# Altium schematic sheet SX1308_GTW_e381v02c_STM32_MCU.SchDoc
size B; DrawnBy: Erik Fountain; DocumentNumber: 3; SheetNumber: 3; SheetTotal: 5; PageSetup: Record=PageOptions|CenterHorizontal=True|CenterVertical=True|PrintScale=0.72|XCorrection=1.00|YCorrection=1.00|PrintKind=0|BorderSize=5000000|LeftOffset=0|BottomOffset=0|Orientation=2|PaperLength=1000|PaperWidth=1000|Scale=100|PaperSource=7|PrintQuality=-4|MediaType=1|DitherType=10|PaperKind=Letter|PrintScaleMode=1
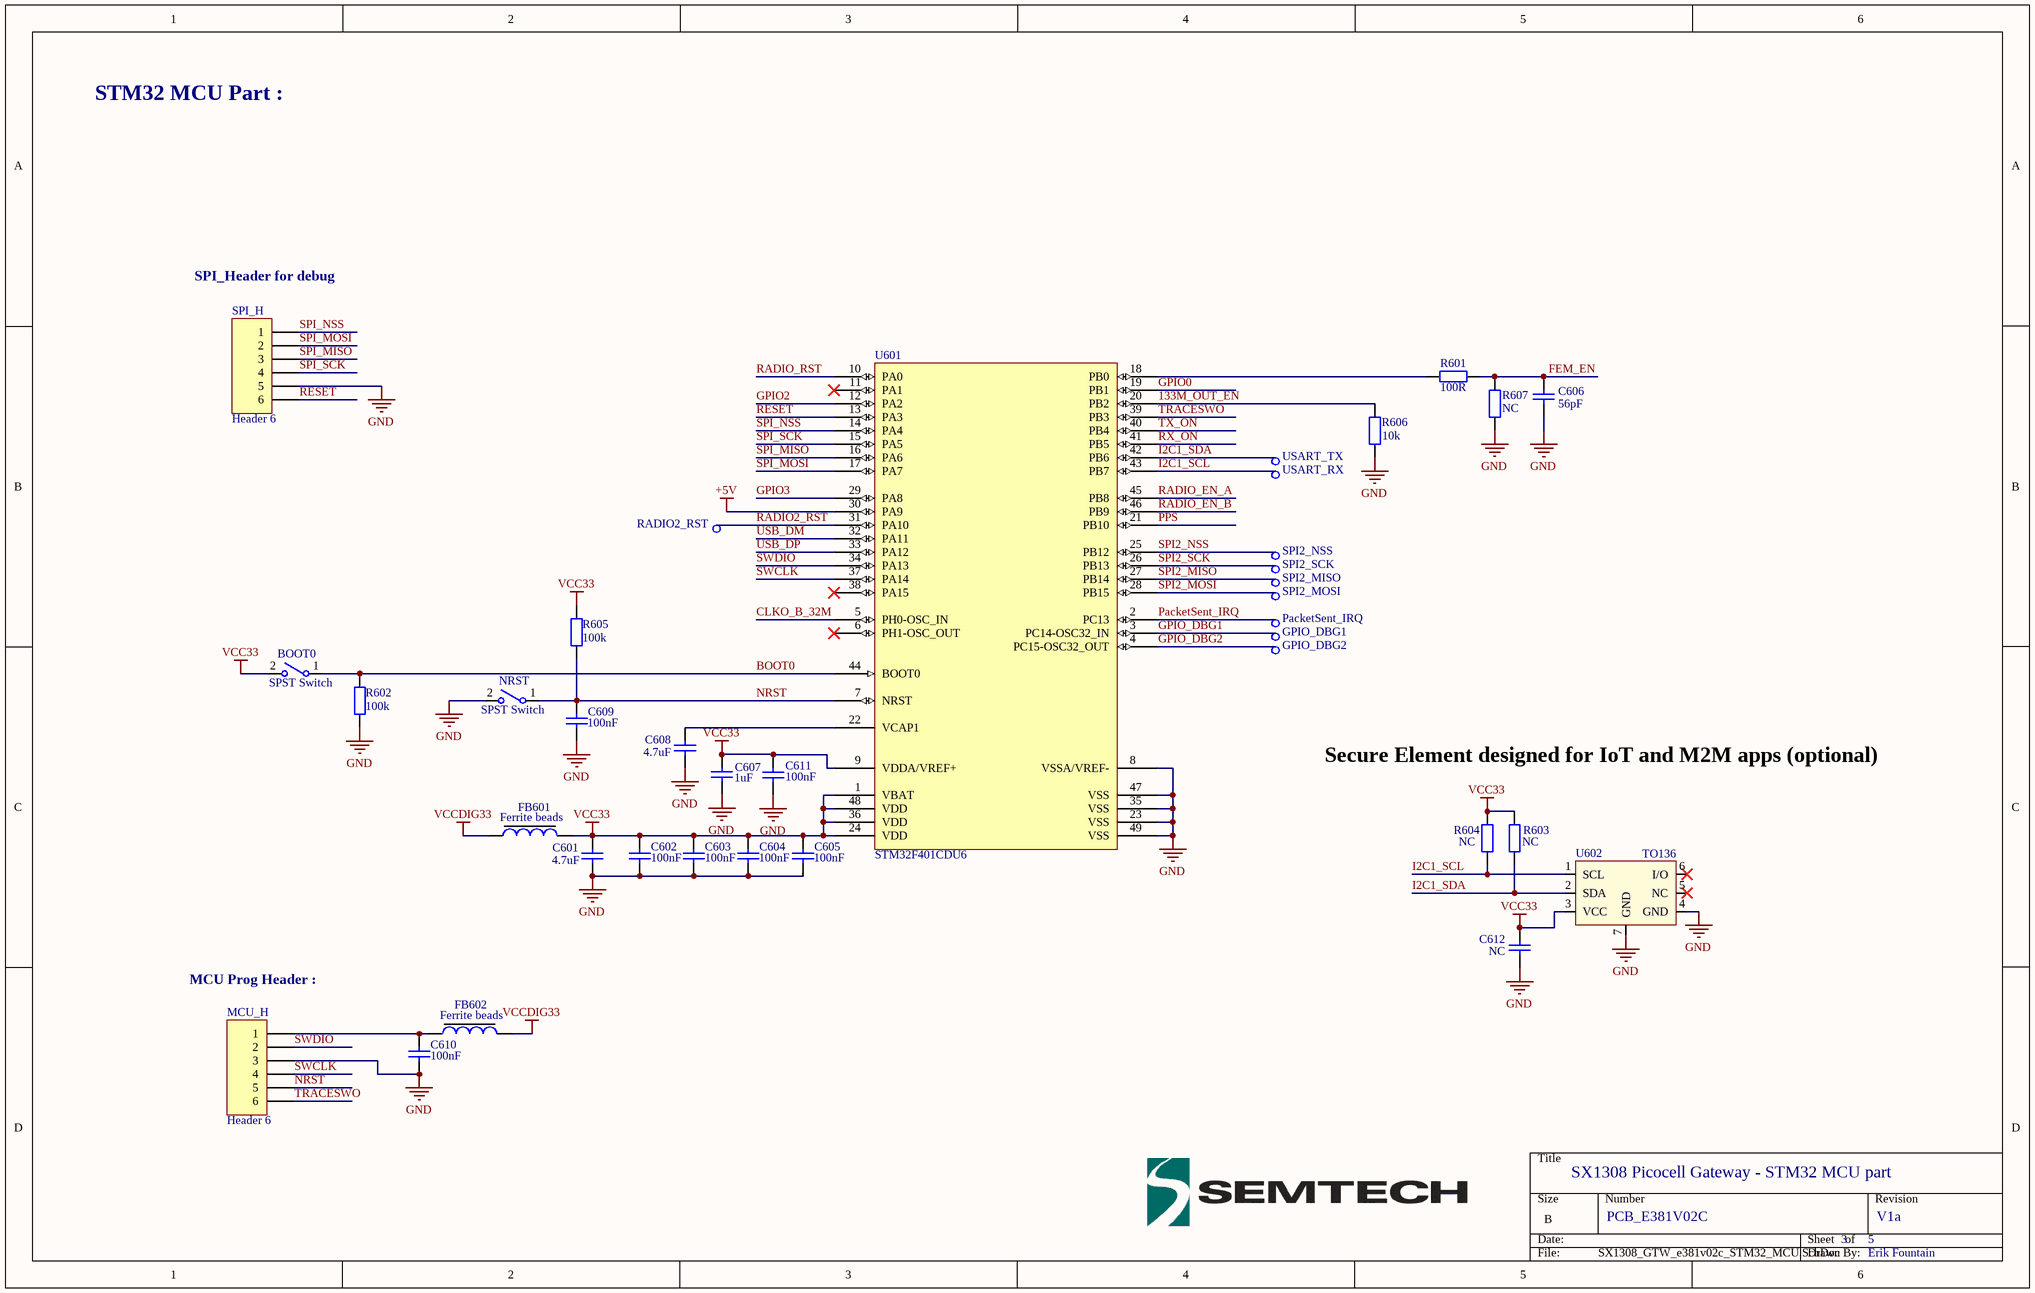
[diagram p0: SX1308_GTW_e381v02c_STM32_MCU.SchDoc]

## Parts
BOOT0  SPST Switch  [KXT_series_switch_3.5x2.0mm]
C601  value 4.7uF  [rlc_603_smd]  (hidden comment: Cap)
C602  value 100nF  [rlc_402_smd]  (hidden comment: Cap)
C603  value 100nF  [rlc_402_smd]  (hidden comment: Cap)
C604  value 100nF  [rlc_402_smd]  (hidden comment: Cap)
C605  value 100nF  [rlc_402_smd]  (hidden comment: Cap)
C606  value 56pF  [rlc_402_smd]  (hidden comment: Cap)
C607  value 1uF  [rlc_402_smd]  (hidden comment: Cap)
C608  value 4.7uF  [rlc_603_smd]  (hidden comment: Cap)
C609  value 100nF  [rlc_402_smd]  (hidden comment: Cap)
C610  value 100nF  [rlc_402_smd]  (hidden comment: Cap)
C611  value 100nF  [rlc_402_smd]  (hidden comment: Cap)
C612  value NC  [rlc_402_smd]  (hidden comment: Cap)
FB601  Ferrite beads  [rlc_402_smd]
FB602  Ferrite beads  [rlc_402_smd]
GPIO_DBG1  Test Pin  [PIN_SMD]  (value not drawn)
GPIO_DBG2  Test Pin  [PIN_SMD]  (value not drawn)
MCU_H  Header 6  [HDR1X6_SMD]
NRST  SPST Switch  [KXT_series_switch_3.5x2.0mm]
PacketSent_IRQ  Test Pin  [PIN_SMD]  (value not drawn)
R601  value 100R  [rlc_402_smd]  (hidden comment: Resistor)
R602  value 100k  [rlc_402_smd]  (hidden comment: Resistor)
R603  value NC  [rlc_201_smd]  (hidden comment: Resistor)
R604  value NC  [rlc_201_smd]  (hidden comment: Resistor)
R605  value 100k  [rlc_402_smd]  (hidden comment: Resistor)
R606  value 10k  [rlc_402_smd]  (hidden comment: Resistor)
R607  value NC  [rlc_402_smd]  (hidden comment: Resistor)
RADIO2_RST  Test Pin  [PIN_SMD]  (value not drawn)
SPI2_MISO  Test Pin  [PIN_SMD]  (value not drawn)
SPI2_MOSI  Test Pin  [PIN_SMD]  (value not drawn)
SPI2_NSS  Test Pin  [PIN_SMD]  (value not drawn)
SPI2_SCK  Test Pin  [PIN_SMD]  (value not drawn)
SPI_H  Header 6  [HDR1X6_SMD]
U601  STM32F401CDU6  [UFQFPN48_7x7MM]
U602  TO136  [DFN6_3X3mm]
USART_RX  Test Pin  [PIN_SMD]  (value not drawn)
USART_TX  Test Pin  [PIN_SMD]  (value not drawn)

## Nets
+5V: U601.30(PA9)
GND: C601.1 C602.1 C603.1 C604.1 C605.1 C606.1 C607.1 C608.1 C609.1 C610.1 C611.1 C612.1 MCU_H.3 NRST.2(NO) R602.1 R606.1 R607.1 SPI_H.5 U601.8(VSSA/VREF-) U601.23(VSS) U601.35(VSS) U601.47(VSS) U601.49(VSS) U602.4(GND) U602.7(GND)
VCC33: BOOT0.2(NO) C601.2 C602.2 C603.2 C604.2 C605.2 C607.2 C611.2 C612.2 FB601.2 R603.2 R604.2 R605.2 U601.1(VBAT) U601.9(VDDA/VREF+) U601.24(VDD) U601.36(VDD) U601.48(VDD) U602.3(VCC)
VCCDIG33: FB601.1 FB602.2
133M_OUT_EN: R606.2 U601.20(PB2)
BOOT0: BOOT0.1(COMMON) R602.2 U601.44(BOOT0)
CLKO_B_32M: U601.5(PH0-OSC_IN)
FEM_EN: C606.2 R601.2 R607.2
GPIO0: U601.19(PB1)
GPIO2: U601.12(PA2)
GPIO3: U601.29(PA8)
GPIO_DBG1: GPIO_DBG1.1(pin) U601.3(PC14-OSC32_IN)
GPIO_DBG2: GPIO_DBG2.1(pin) U601.4(PC15-OSC32_OUT)
I2C1_SCL: R604.1 U601.43(PB7) U602.1(SCL) USART_RX.1(pin)
I2C1_SDA: R603.1 U601.42(PB6) U602.2(SDA) USART_TX.1(pin)
NRST: C609.2 MCU_H.5 NRST.1(COMMON) R605.1 U601.7(NRST)
PacketSent_IRQ: PacketSent_IRQ.1(pin) U601.2(PC13)
PPS: U601.21(PB10)
RADIO2_RST: RADIO2_RST.1(pin) U601.31(PA10)
RADIO_EN_A: U601.45(PB8)
RADIO_EN_B: U601.46(PB9)
RADIO_RST: U601.10(PA0)
RESET: SPI_H.6 U601.13(PA3)
RX_ON: U601.41(PB5)
SPI2_MISO: SPI2_MISO.1(pin) U601.27(PB14)
SPI2_MOSI: SPI2_MOSI.1(pin) U601.28(PB15)
SPI2_NSS: SPI2_NSS.1(pin) U601.25(PB12)
SPI2_SCK: SPI2_SCK.1(pin) U601.26(PB13)
SPI_MISO: SPI_H.3 U601.16(PA6)
SPI_MOSI: SPI_H.2 U601.17(PA7)
SPI_NSS: SPI_H.1 U601.14(PA4)
SPI_SCK: SPI_H.4 U601.15(PA5)
SWCLK: MCU_H.4 U601.37(PA14)
SWDIO: MCU_H.2 U601.34(PA13)
TRACESWO: MCU_H.6 U601.39(PB3)
TX_ON: U601.40(PB4)
USB_DM: U601.32(PA11)
USB_DP: U601.33(PA12)
NetC608_2: C608.2 U601.22(VCAP1)
NetC610_2: C610.2 FB602.1 MCU_H.1
NetR601_1: R601.1 U601.18(PB0)

Not connected (* = marked no-connect by the designer): U601 6(PH1-OSC_OUT)* 11(PA1)* 38(PA15)*; U602 5(NC)* 6(I/O)*

## Notes on the sheet
- STM32 MCU Part :
- (near SPI_H) SPI_Header for debug
- Secure Element designed for IoT and M2M apps (optional)
- (near MCU_H) MCU Prog Header :
- SX1308 Picocell Gateway - STM32 MCU part
- PCB_E381V02C
- V1a

## Library data of the parts
BOOT0 NRST = SW-SPST: SPST, N.O. - Tactile Switch; Value: KXT121LHS; Published: 22-Nov-2016
C601-C612 = Cap: Capacitor SMD; Published: 8-Jun-2000; LatestRevisionDate: 05-oct-2007  -  Semtech; LatestRevisionNote: Re-released for DXP Platform.; Publisher: Altium Limited
FB601 FB602 = Ferrite beads: Value: VAL?
GPIO_DBG1 GPIO_DBG2 PacketSent_IRQ RADIO2_RST SPI2_MISO SPI2_MOSI SPI2_NSS SPI2_SCK USART_RX USART_TX = test_pin: LatestRevisionDate: 05-oct-2007  -  Semtech
MCU_H SPI_H = Header 6: Header, 6-Pin; LatestRevisionDate: 17-Jul-2002; LatestRevisionNote: Re-released for DXP Platform.; Publisher: Altium Limited
R601-R607 = Resistor: Resistor SMD - IEC symbol version; LatestRevisionDate: 27-Jul-20  -  Semtech
U601 = STM32F401CDU6: STM32 ARM Cortex M4 32-bit MCU with 256Kbytes Flash/96kB RAM, UFQFPN48 package; ComponentLink1Description: Manufacturer Link; ComponentLink1URL: www.st.com/stm32
U602 = TO136: TO136 - Secure Element designed for IoT and M2M applications.; LatestRevisionDate: 26-Feb-2016 -  Semtech